# EAGLE schematic autostepper (EAGLE 7.6.0)
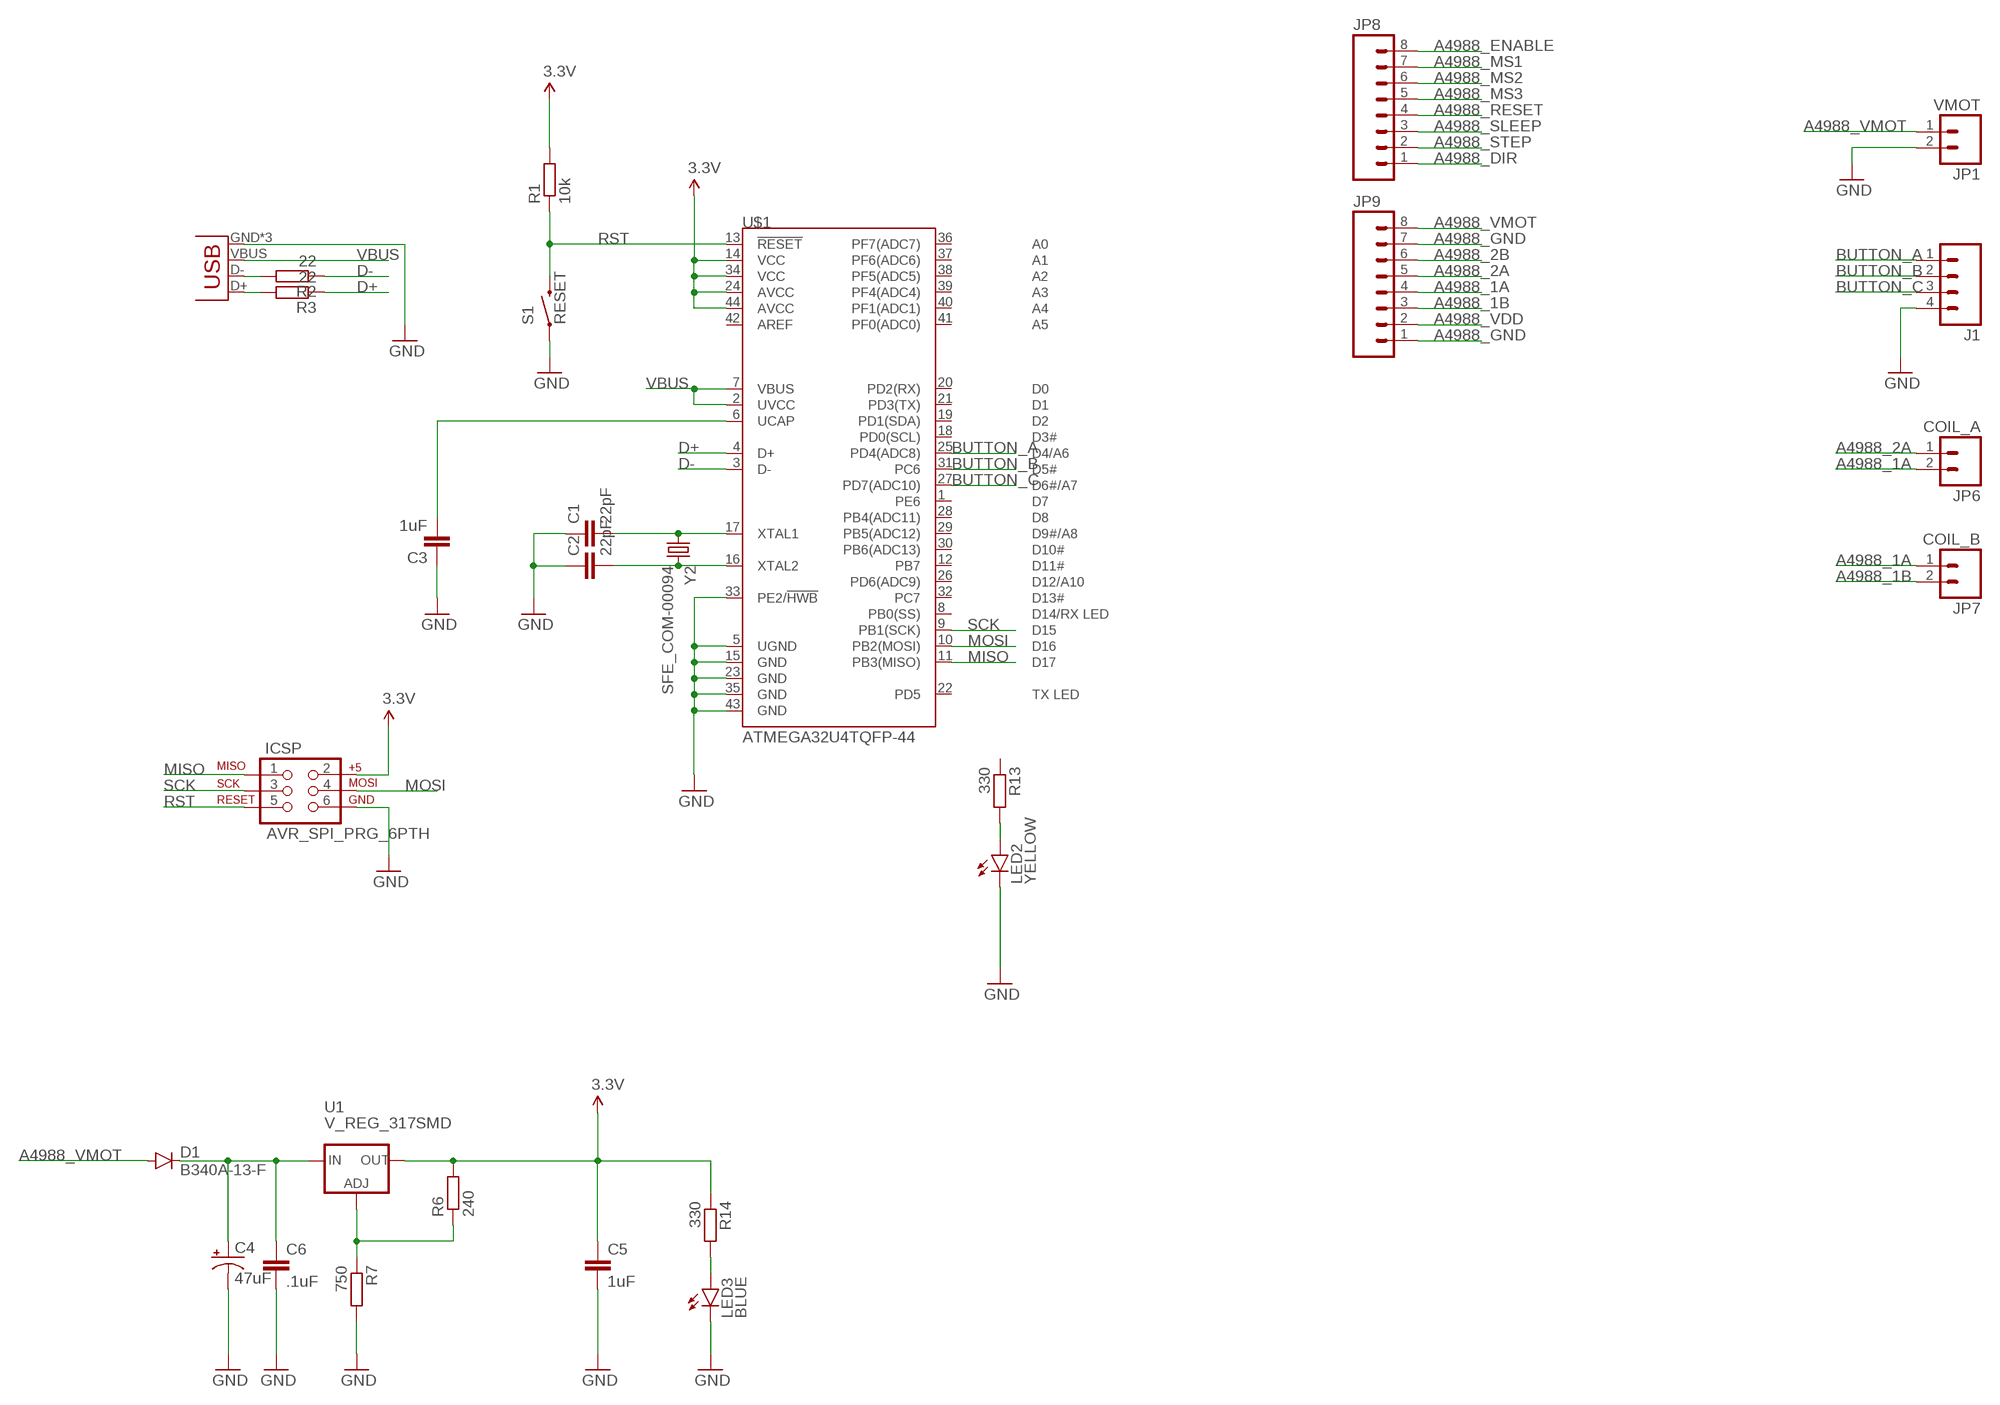
[diagram p0: schematic, sheet 1]

## Parts
C1  22pF  CAP1206  [1206]
C2  22pF  CAP1206  [1206]
C3  1uF  CAP1206  [1206]
C4  47uF  CAP_POLD  [PANASONIC_D]
C5  1uF  CAP1206  [1206]
C6  .1uF  CAP1206  [1206]
D1  B340A-13-F  DIODEHV  [DIODE-HV]
ICSP  AVR_SPI_PRG_6PTH  [2X3]
J1  M04LONGPADS  [1X04_LONGPADS]
JP1  VMOT  M025MM  [SCREWTERMINAL-5MM-2]
JP2  USB-MICROB  [USB-MICROB]
JP6  COIL_A  M025MM  [SCREWTERMINAL-5MM-2]
JP7  COIL_B  M025MM  [SCREWTERMINAL-5MM-2]
JP8  M08LONGPADS  [1X08_LONGPADS]
JP9  M08LONGPADS  [1X08_LONGPADS]
LED2  YELLOW  LED0603  [LED-0603]
LED3  BLUE  LED0603  [LED-0603]
R1  10k  R-EU_M0805  [M0805]
R2  22  R-EU_M0805  [M0805]
R3  22  R-EU_M0805  [M0805]
R6  240  R-EU_M0805  [M0805]
R7  750  R-EU_M0805  [M0805]
R13  330  R-EU_M0805  [M0805]
R14  330  R-EU_M0805  [M0805]
S1  RESET  SWITCH-MOMENTARY-2SMD  [TACTILE-SWITCH-SMD]
U1  V_REG_317SMD  [SOT223]
U$1  ATMEGA32U4TQFP-44  [TQFP44]
Y2  SFE_COM-00094  CRYSTAL5X3  [CRYSTAL-SMD-5X3]

## Nets
3.3V: C5.1 ICSP.2 R1.2 R6.2 R14.1 U1.2(OUT) U$1.14(VCC) U$1.24(AVCC) U$1.34(VCC) U$1.44(AVCC)
A4988_1A: JP6.2 JP7.1 JP9.4
A4988_1B: JP7.2 JP9.3
A4988_2A: JP6.1 JP9.5
A4988_2B: JP9.6
A4988_DIR: JP8.1
A4988_ENABLE: JP8.8
A4988_GND: JP9.1 JP9.7
A4988_MS1: JP8.7
A4988_MS2: JP8.6
A4988_MS3: JP8.5
A4988_RESET: JP8.4
A4988_SLEEP: JP8.3
A4988_STEP: JP8.2
A4988_VDD: JP9.2
A4988_VMOT: D1.A JP1.1 JP9.8
BUTTON_A: J1.1 U$1.25(PD4(ADC8))
BUTTON_B: J1.2 U$1.31(PC6)
BUTTON_C: J1.3 U$1.27(PD7(ADC10))
D+: R3.1 U$1.4(D+)
D-: R2.1 U$1.3(D-)
GND: C1.1 C2.1 C3.1 C4.- C5.2 C6.2 ICSP.6 J1.4 JP1.2 JP2.GND JP2.MT1(GND) JP2.MT2(GND) LED2.C LED3.C R7.2 S1.1 U$1.5(UGND) U$1.15(GND) U$1.23(GND) U$1.33(PE2/!HWB) U$1.35(GND) U$1.43(GND)
MISO: ICSP.1 U$1.11(PB3(MISO))
MOSI: ICSP.4 U$1.10(PB2(MOSI))
N$1: C1.2 U$1.17(XTAL1) Y2.1
N$2: C2.2 U$1.16(XTAL2) Y2.3
N$4: JP2.D- R2.2
N$5: JP2.D+ R3.2
N$6: C3.2 U$1.6(UCAP)
N$7: R6.1 R7.1 U1.1(ADJ)
N$8: C4.+ C6.1 D1.C U1.3(IN)
N$12: LED2.A R13.2
N$13: LED3.A R14.2
RST: ICSP.5 R1.1 S1.3 U$1.13(!RESET)
SCK: ICSP.3 U$1.9(PB1(SCK))
VBUS: JP2.VBUS U$1.2(UVCC) U$1.7(VBUS)
Unconnected: R13.1 U$1.1(PE6) U$1.8(PB0(SS)) U$1.12(PB7) U$1.18(PD0(SCL)) U$1.19(PD1(SDA)) U$1.20(PD2(RX)) U$1.21(PD3(TX)) U$1.22(PD5) U$1.26(PD6(ADC9)) U$1.28(PB4(ADC11)) U$1.29(PB5(ADC12)) U$1.30(PB6(ADC13)) U$1.32(PC7) U$1.36(PF7(ADC7)) U$1.37(PF6(ADC6)) U$1.38(PF5(ADC5)) U$1.39(PF4(ADC4)) U$1.40(PF1(ADC1)) U$1.41(PF0(ADC0)) U$1.42(AREF)

## Library data of the parts
C1-C3 C5 C6 = SparkFun-Passives:CAP: Capacitor Standard 0603 ceramic capacitor, and 0.1" leaded capacitor.
C4 = SparkFun-Passives:CAP_POL: Capacitor Polarized These are standard SMD and PTH capacitors. Normally 10uF, 47uF, and 100uF in electrolytic and tantalum varieties. Always verify the external diameter of the through hole cap, it varies with capacity, voltage, and manufacturer. The EIA devices should be standard.
D1 = SparkFun-DiscreteSemi:DIODE: Diode These are standard reverse protection diodes and small signal diodes. SMA package can handle up to about 1A. SOD-323 can handle about 200mA. What the SOD-323 package when ordering, there are some mfgs out there that are 5-pin packages.
ICSP = SparkFun-Connectors:AVR_SPI_PRG_6: AVR ISP 6 Pin This is the reduced ISP connector for AVR programming. Common on Arduino. This footprint will take up less PCB space and can be used with a 10-pin to 6-pin adapter such as SKU: BOB-08508 **Special note about "TEST_POINT" package. The stop mask is on the top side, so if you want your programming test points to be on the bottom of your board, make sure to place this package on the bottom side of the board. This also ensure that the orientation to program from the bottom side will be correct.
J1 = SparkFun-Connectors:M04: Header 4 Standard 4-pin 0.1" header. Use with straight break away headers (SKU : PRT-00116), right angle break away headers (PRT-00553), swiss pins (PRT-00743), machine pins (PRT-00117), and female headers (PRT-00115). Molex polarized connector foot print use with SKU : PRT-08231 with associated crimp pins and housings. 1MM SMD Version SKU: PRT-10208; PROD_ID: CONN-09696
JP1 JP6 JP7 = SparkFun-Connectors:M02: Standard 2-pin 0.1" header. Use with - straight break away headers ( PRT-00116) - right angle break away headers (PRT-00553) - swiss pins (PRT-00743) - machine pins (PRT-00117) - female headers (PRT-00115) Molex polarized connector foot print use with: PRT-08233 with associated crimp pins and housings. 2.54_SCREWTERM for use with PRT-10571. 3.5mm Screw Terminal footprints for PRT-08084 5mm Screw Terminal footprints for use with PRT-08433
JP2 = SparkFun-Connectors:USB: USB Connectors USB-B-PTH is fully proven SKU : PRT-00139/CONN-08278 USB-miniB is fully proven SKU : PRT-00587 USB-A-PCB is untested. USB-A-H is throughly reviewed, but untested. Spark Fun Electronics SKU : PRT-00437 USB-B-SMT is throughly reviewed, but untested. Needs silkscreen touching up. USB-A-S has not been used/tested USB-MB-H has not been used/tested USB-MICROB has been used. CONN-09505; PROD_ID: CONN-09505
JP8 JP9 = SparkFun-Connectors:M08: Header 8 Standard 8-pin 0.1" header. Use with straight break away headers (SKU : PRT-00116), right angle break away headers (PRT-00553), swiss pins (PRT-00743), machine pins (PRT-00117), and female headers (PRT-00115).
LED2 LED3 = SparkFun-LED:LED: LEDs Standard schematic elements and footprints for 5mm, 3mm, 1206, and 0603 sized LEDs. 5mm - Spark Fun Electronics SKU : COM-00529 (and others)
R1-R3 R6 R7 R13 R14 = rcl:R-EU_: RESISTOR, European symbol
S1 = SparkFun-Electromechanical:SWITCH-MOMENTARY-2: Various NO switches- pushbuttons, reed, etc
U1 = SparkFun-PowerIC:V_REG_317: Voltage Regulator Standard LM317 adjustable voltage regulator. AOI (Adjust Output Input). Google 'LM317 Calculator' for easy to use app to get the two resistor values needed. 240/720 for 5V output. 240/390 for 3.3V output. Spark Fun Electronics SKU : COM-00527
U$1 = SparkFun-DigitalIC:ATMEGA32U4: Atmel 44-pin 8-bit Microcontroller with 32KBytes of ISP Flash and USB Controller
Y2 = SparkFun-FreqCtrl:CRYSTAL: Various standard crystals. Proven footprints. Spark Fun Electronics SKU : COM-00534